# EAGLE design MF-DECODER (EAGLE 5.10)

## Sheet 1 of 4
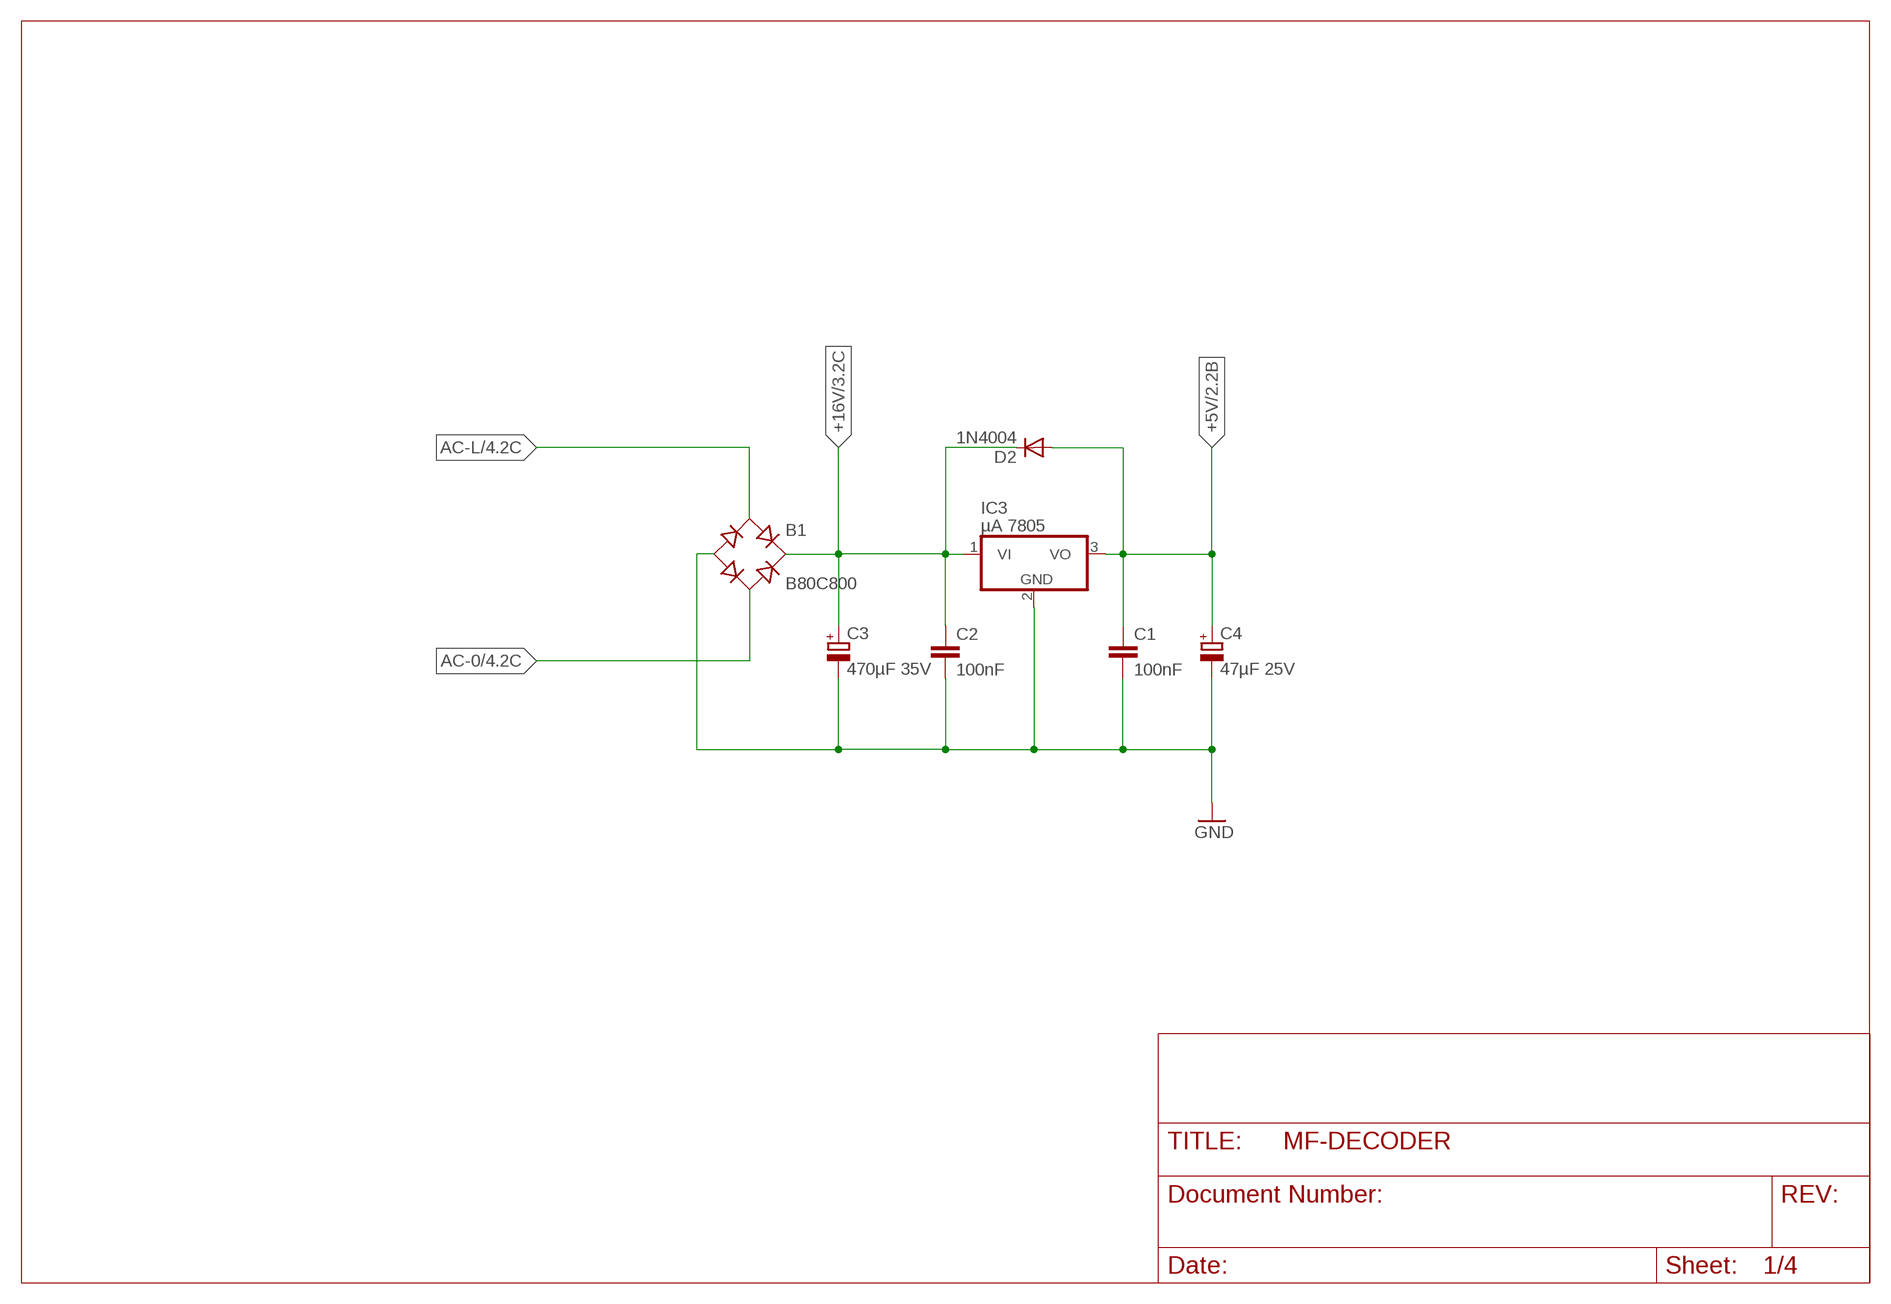
[diagram p0: schematic, sheet 1]

### Parts
B1  B80C800  RECTIFIER-B40S  [B40S]
C1  100nF  C2.5/2  [C2.5-2]
C2  100nF  C2.5/2  [C2.5-2]
C3  470µF 35V  CPOL-EUE5-10.5  [E5-10,5]
C4  47µF 25V  CPOL-EUE2.5-5  [E2,5-5]
D2  1N4004  [DO41-10]
IC3  µA 7805  7805TV  [TO220V]

### Nets
+5V: C1.1 C4.+ D2.A IC3.3(VO) ; also sheet 2,3,4
+16V: B1.+ C2.1 C3.+ D2.C IC3.1(VI) ; also sheet 3,4
AC-0: B1.AC2 ; also sheet 4
AC-L: B1.AC1 ; also sheet 4
GND: B1.- C1.2 C2.2 C3.- C4.- IC3.2(GND) ; also sheet 2,3,4

## Sheet 2 of 4
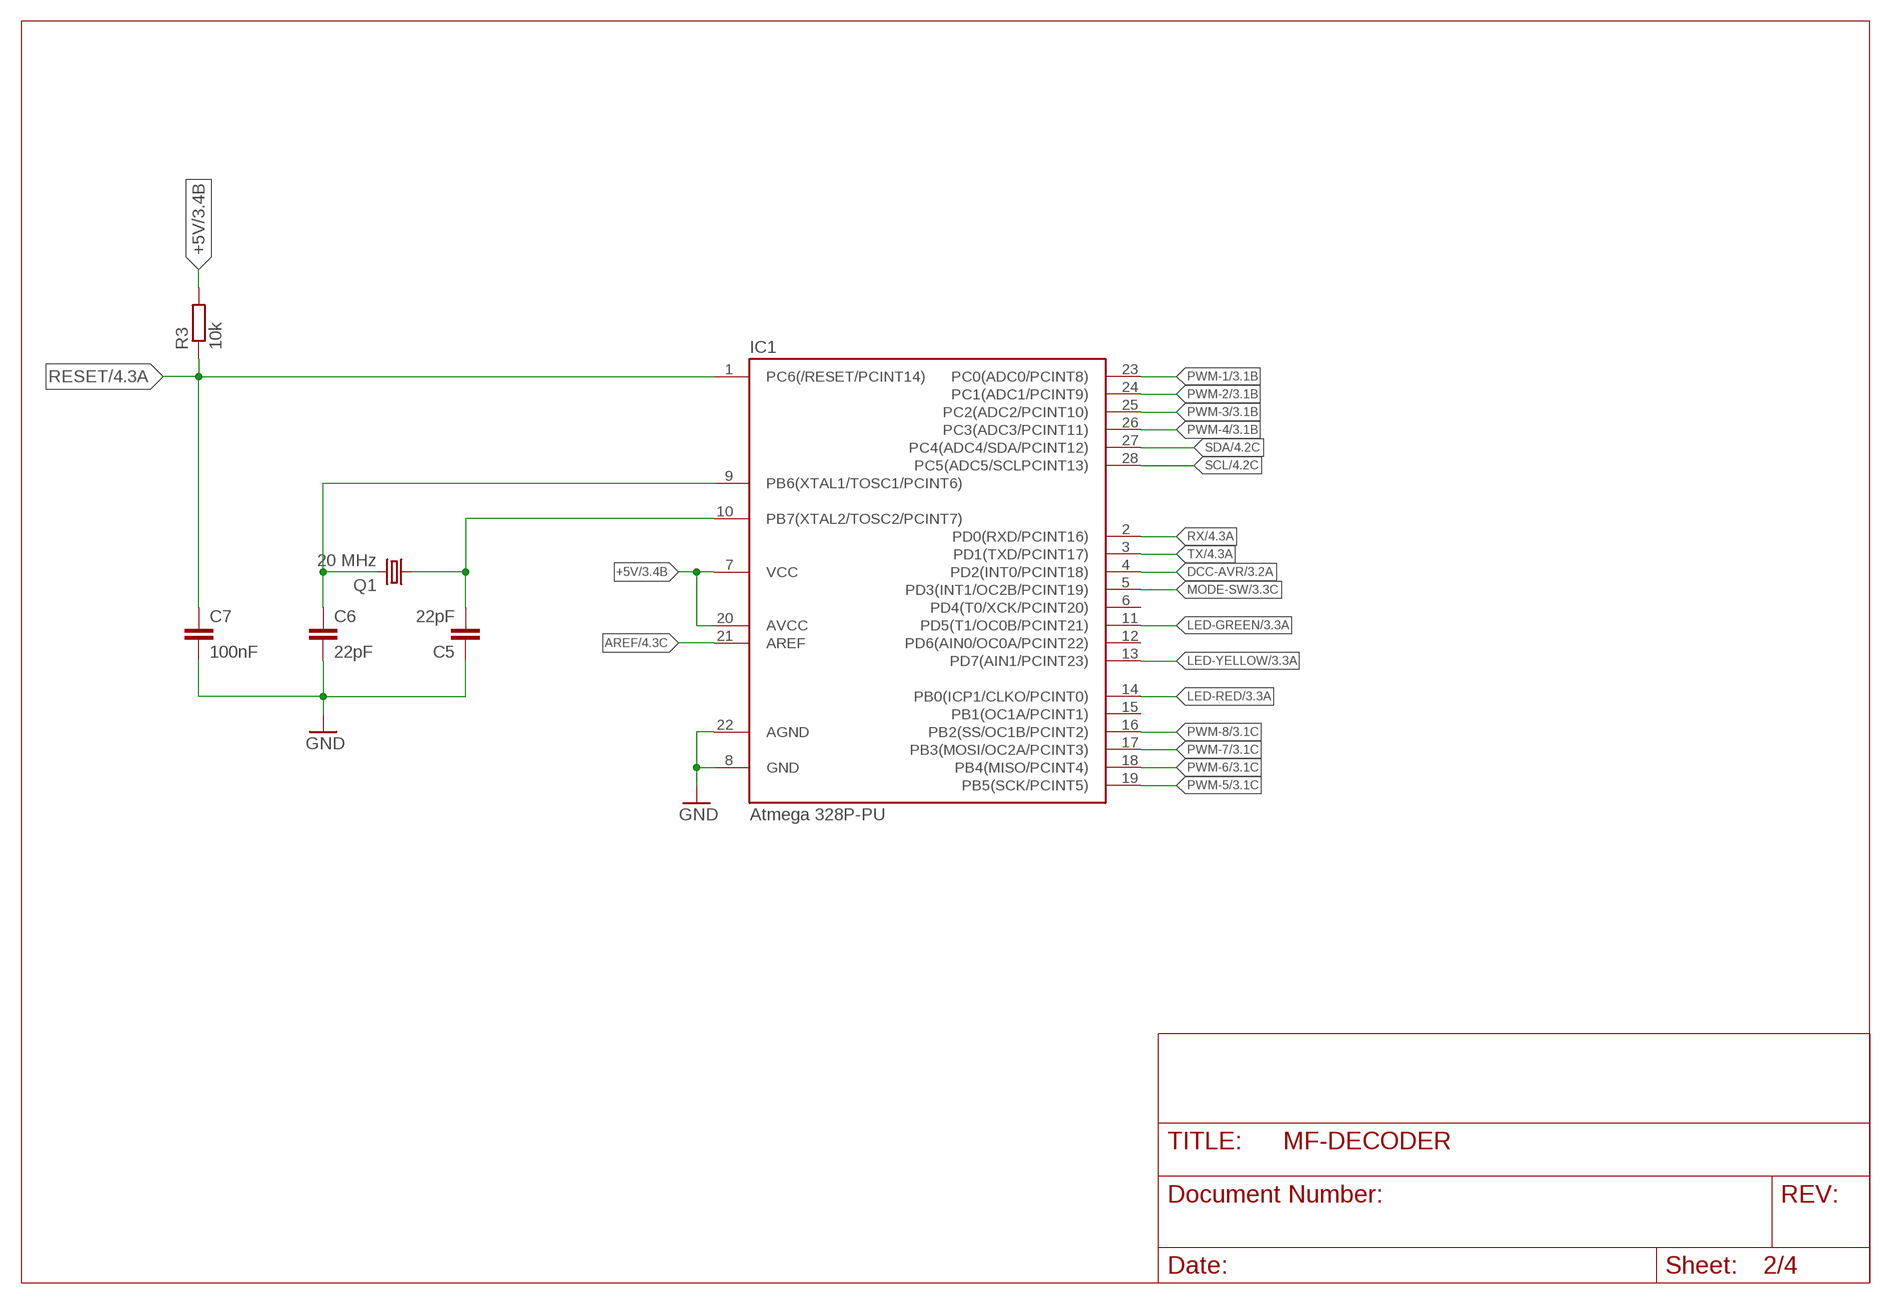
[diagram p1: schematic, sheet 2]

### Parts
C5  22pF  C2.5/2  [C2.5-2]
C6  22pF  C2.5/2  [C2.5-2]
C7  100nF  C2.5/2  [C2.5-2]
IC1  Atmega 328P-PU  MEGA48/88/168-PU  [DIL28-3]
Q1  20 MHz  CRYSTALHC49S  [HC49/S]
R3  10k  R-EU_R1206  [R1206]

### Nets
+5V: IC1.7(VCC) IC1.20(AVCC) R3.2 ; also sheet 1,3,4
AREF: IC1.21(AREF) ; also sheet 4
DCC-AVR: IC1.4(PD2(INT0/PCINT18)) ; also sheet 3
GND: C5.1 C6.2 C7.2 IC1.8(GND) IC1.22(AGND) ; also sheet 1,3,4
LED-GREEN: IC1.11(PD5(T1/OC0B/PCINT21)) ; also sheet 3
LED-RED: IC1.14(PB0(ICP1/CLKO/PCINT0)) ; also sheet 3
LED-YELLOW: IC1.13(PD7(AIN1/PCINT23)) ; also sheet 3
MODE-SW: IC1.5(PD3(INT1/OC2B/PCINT19)) ; also sheet 3
PWM-1: IC1.23(PC0(ADC0/PCINT8)) ; also sheet 3
PWM-2: IC1.24(PC1(ADC1/PCINT9)) ; also sheet 3
PWM-3: IC1.25(PC2(ADC2/PCINT10)) ; also sheet 3
PWM-4: IC1.26(PC3(ADC3/PCINT11)) ; also sheet 3
PWM-5: IC1.19(PB5(SCK/PCINT5)) ; also sheet 3,4
PWM-6: IC1.18(PB4(MISO/PCINT4)) ; also sheet 3,4
PWM-7: IC1.17(PB3(MOSI/OC2A/PCINT3)) ; also sheet 3,4
PWM-8: IC1.16(PB2(SS/OC1B/PCINT2)) ; also sheet 3
RESET: C7.1 IC1.1(PC6(/RESET/PCINT14)) R3.1 ; also sheet 4
RX: IC1.2(PD0(RXD/PCINT16)) ; also sheet 4
SCL: IC1.28(PC5(ADC5/SCLPCINT13)) ; also sheet 4
SDA: IC1.27(PC4(ADC4/SDA/PCINT12)) ; also sheet 4
TX: IC1.3(PD1(TXD/PCINT17)) ; also sheet 4
XTAL1: C6.1 IC1.9(PB6(XTAL1/TOSC1/PCINT6)) Q1.2
XTAL2: C5.2 IC1.10(PB7(XTAL2/TOSC2/PCINT7)) Q1.1
Unconnected: IC1.6(PD4(T0/XCK/PCINT20)) IC1.12(PD6(AIN0/OC0A/PCINT22)) IC1.15(PB1(OC1A/PCINT1))

## Sheet 3 of 4
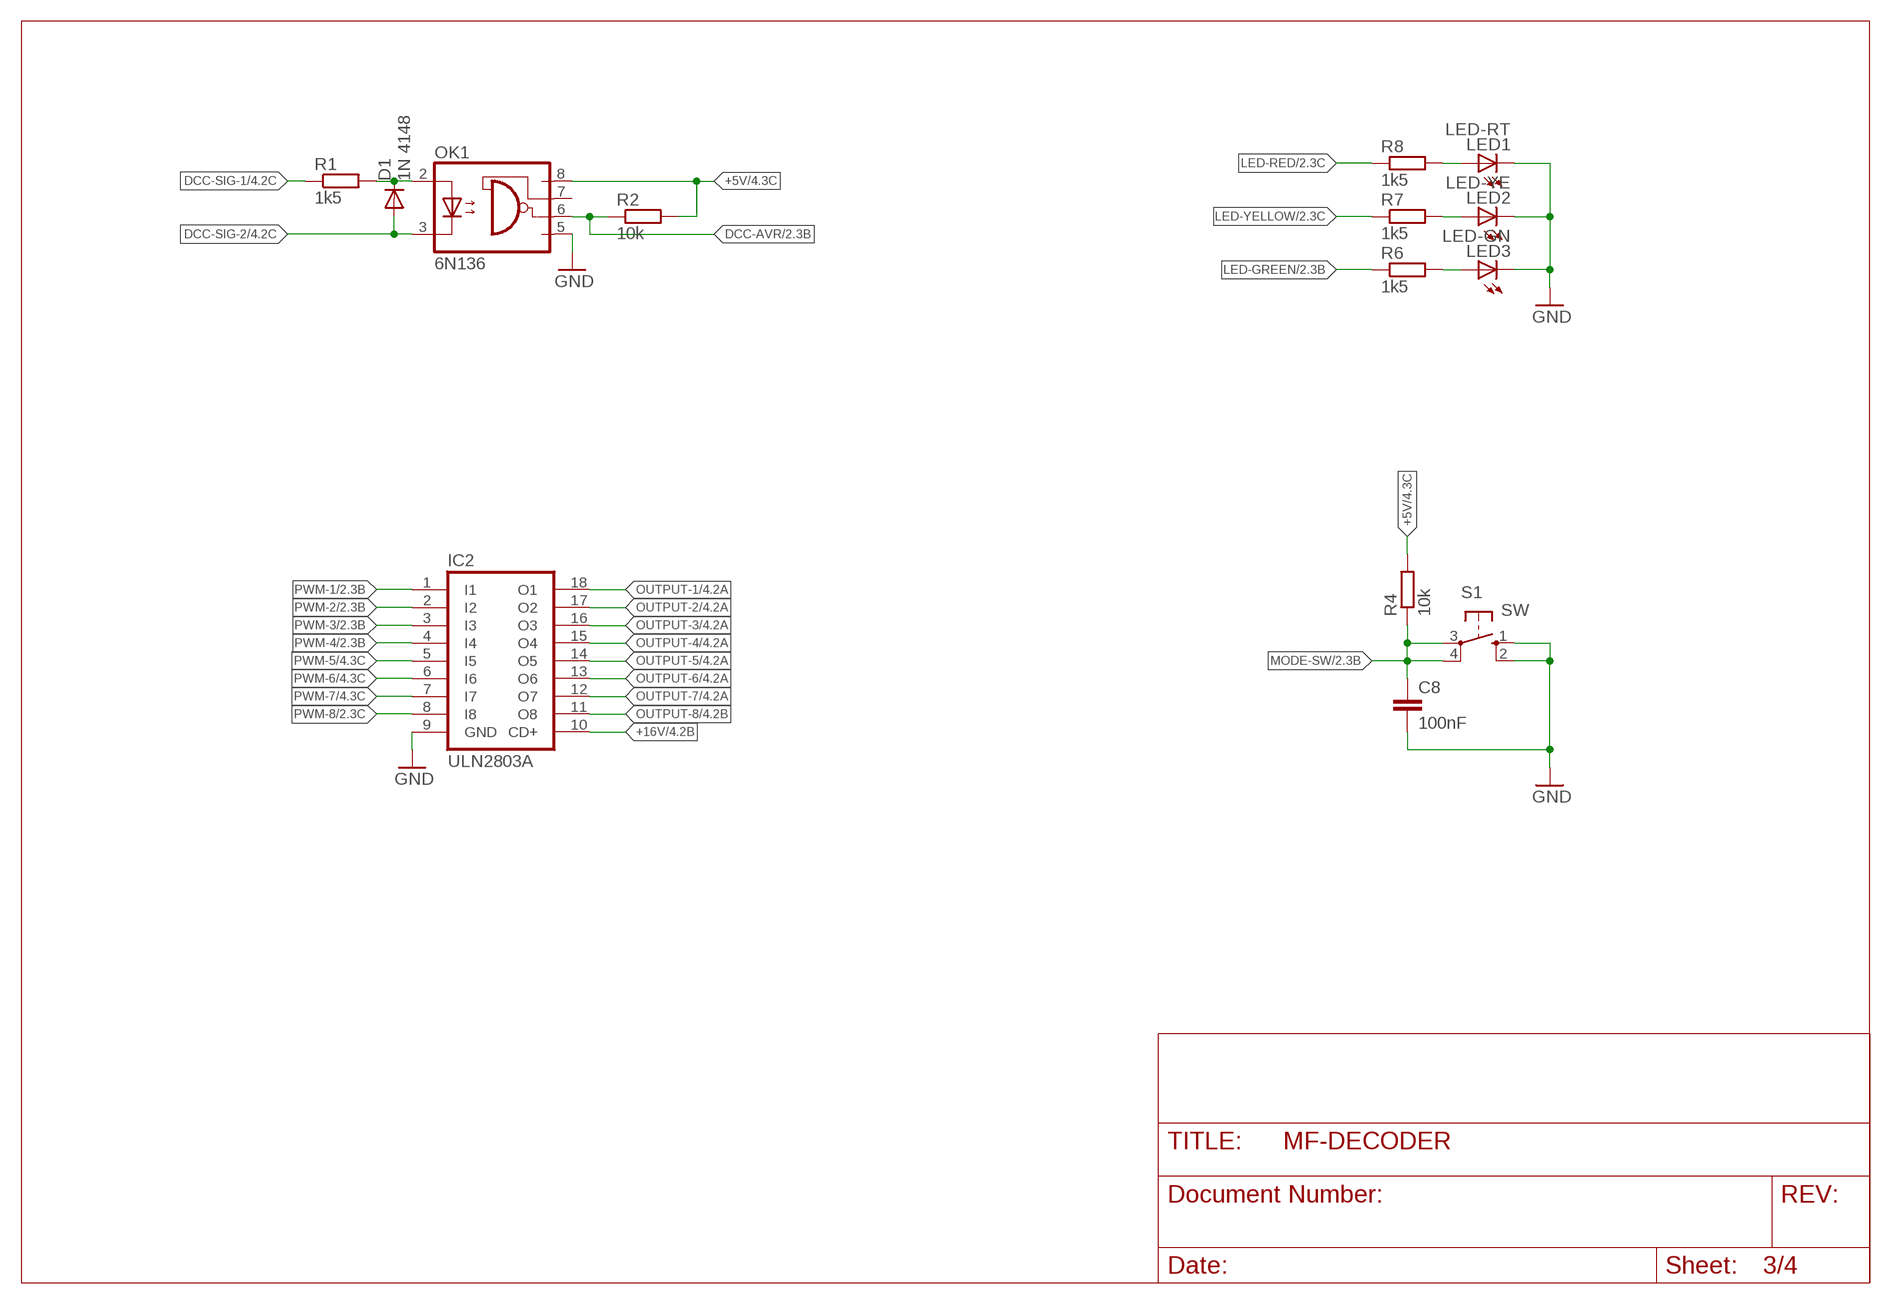
[diagram p2: schematic, sheet 3]

### Parts
C8  100nF  C2.5/2  [C2.5-2]
D1  1N 4148  DIODE-SOD80C  [SOD80C]
IC2  ULN2803A  [DIL18]
LED1  LED-RT  LED3MM  [LED3MM]
LED2  LED-YE  LED3MM  [LED3MM]
LED3  LED-GN  LED3MM  [LED3MM]
OK1  6N136  6N137  [DIL08]
R1  1k5  R-EU_R1206  [R1206]
R2  10k  R-EU_R1206  [R1206]
R4  10k  R-EU_R1206  [R1206]
R6  1k5  R-EU_R1206  [R1206]
R7  1k5  R-EU_R1206  [R1206]
R8  1k5  R-EU_R1206  [R1206]
S1  SW  10-XX  [B3F-10XX]

### Nets
+5V: OK1.8(VCC) R2.2 R4.2 ; also sheet 1,2,4
+16V: IC2.10(CD+) ; also sheet 1,4
DCC-AVR: OK1.6(VO) R2.1 ; also sheet 2
DCC-SIG-1: R1.1 ; also sheet 4
DCC-SIG-2: D1.A OK1.3(C) ; also sheet 4
GND: C8.2 IC2.9(GND) LED1.K(C) LED2.K(C) LED3.K(C) OK1.5(GND) S1.1(S) S1.2(S1) ; also sheet 1,2,4
LED-GREEN: R6.1 ; also sheet 2
LED-RED: R8.1 ; also sheet 2
LED-YELLOW: R7.1 ; also sheet 2
MODE-SW: C8.1 R4.1 S1.3(P) S1.4(P1) ; also sheet 2
N$1: LED1.A R8.2
N$3: LED2.A R7.2
N$4: LED3.A R6.2
N$7: D1.C OK1.2(A) R1.2
OUTPUT-1: IC2.18(O1) ; also sheet 4
OUTPUT-2: IC2.17(O2) ; also sheet 4
OUTPUT-3: IC2.16(O3) ; also sheet 4
OUTPUT-4: IC2.15(O4) ; also sheet 4
OUTPUT-5: IC2.14(O5) ; also sheet 4
OUTPUT-6: IC2.13(O6) ; also sheet 4
OUTPUT-7: IC2.12(O7) ; also sheet 4
OUTPUT-8: IC2.11(O8) ; also sheet 4
PWM-1: IC2.1(I1) ; also sheet 2
PWM-2: IC2.2(I2) ; also sheet 2
PWM-3: IC2.3(I3) ; also sheet 2
PWM-4: IC2.4(I4) ; also sheet 2
PWM-5: IC2.5(I5) ; also sheet 2,4
PWM-6: IC2.6(I6) ; also sheet 2,4
PWM-7: IC2.7(I7) ; also sheet 2,4
PWM-8: IC2.8(I8) ; also sheet 2
Unconnected: OK1.7(VE)

## Sheet 4 of 4
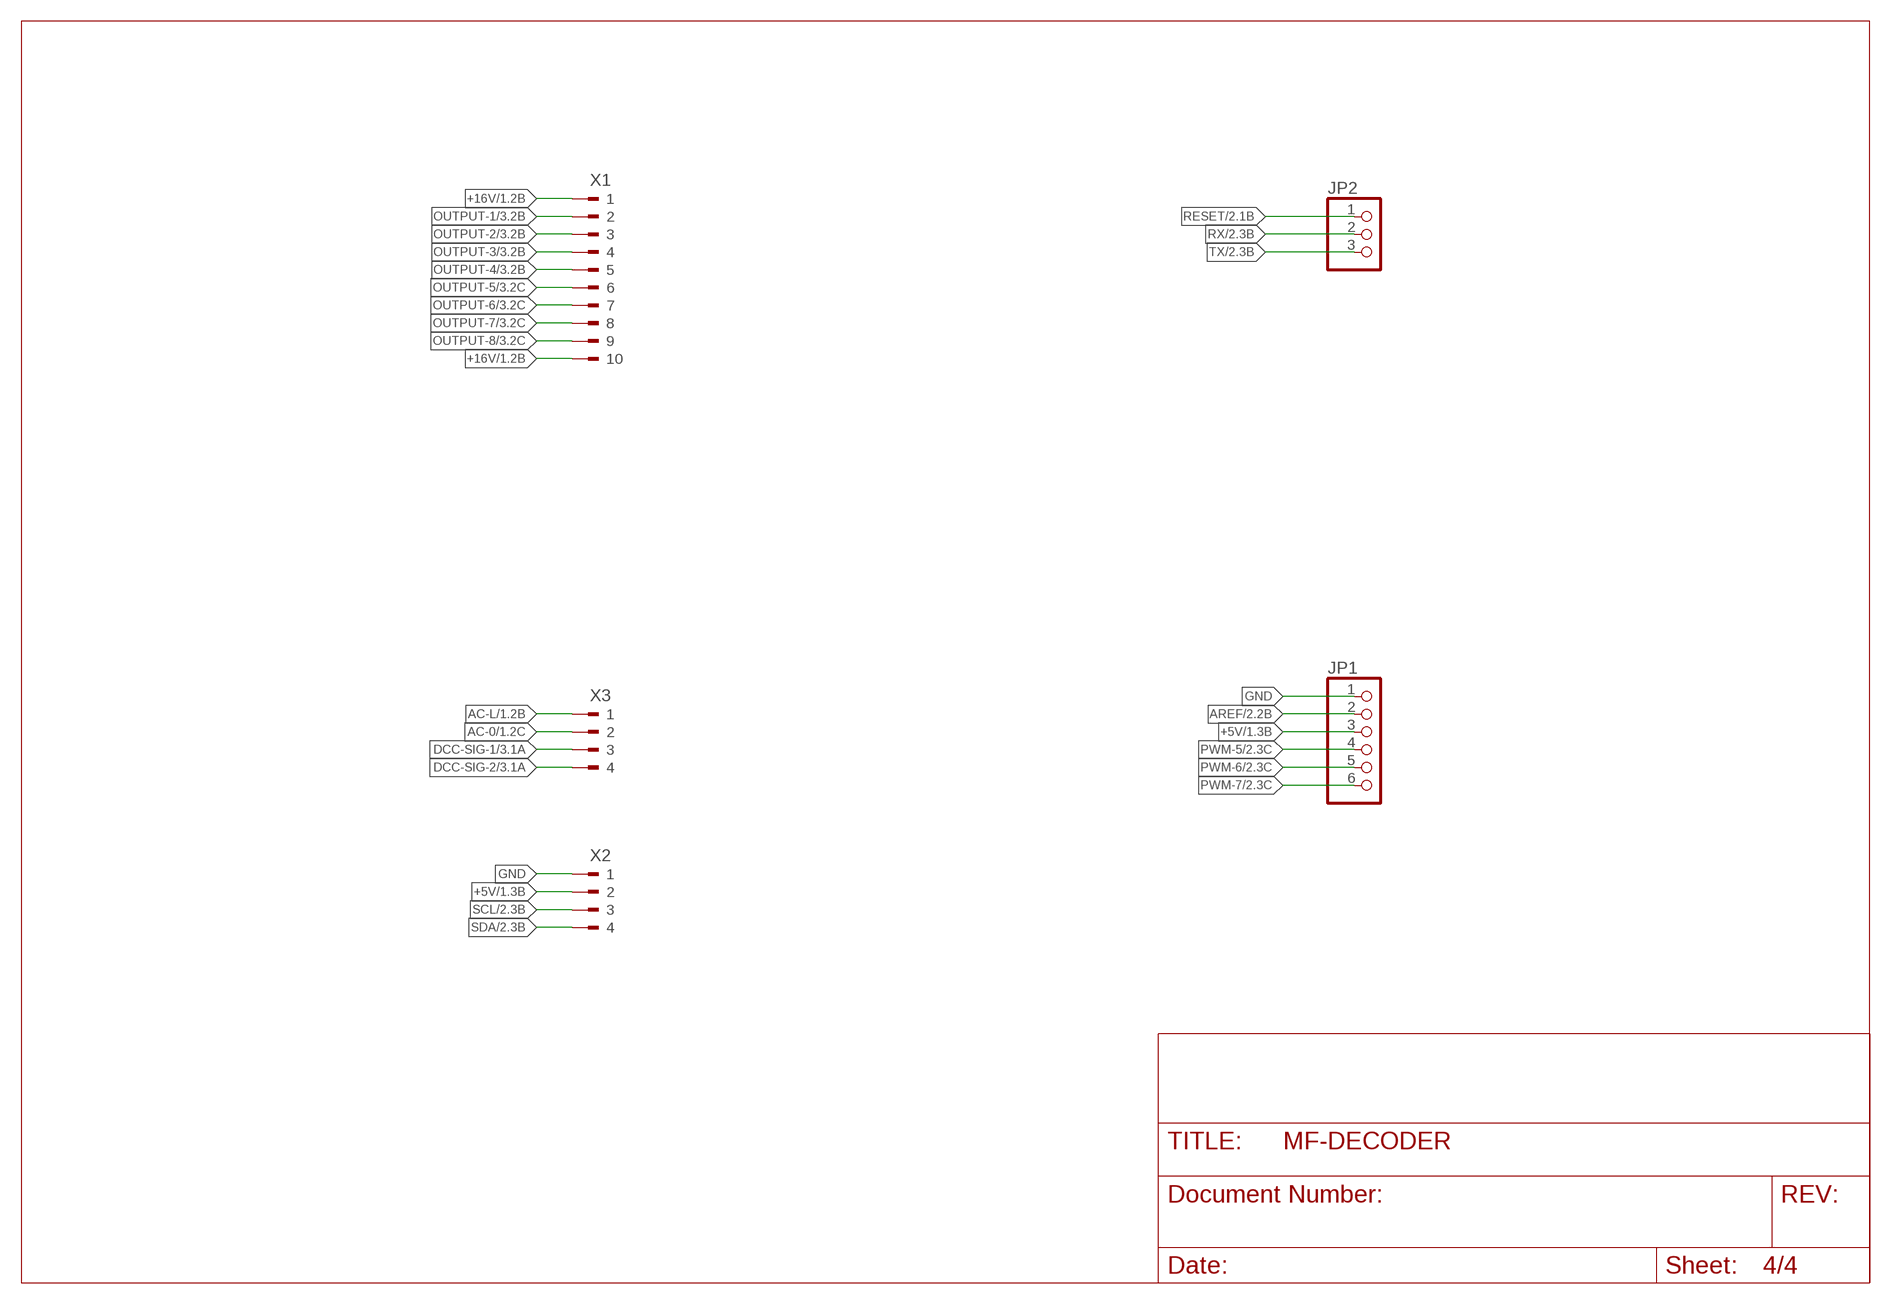
[diagram p3: schematic, sheet 4]

### Parts
JP1  PINHD-1X6  [1X06]
JP2  PINHD-1X3  [1X03]
X1  180G-10  [180G-10]
X2  180G-4  [180G-4]
X3  180G-4  [180G-4]

### Nets
+5V: JP1.3 X2.2 ; also sheet 1,2,3
+16V: X1.1 X1.10 ; also sheet 1,3
AC-0: X3.2 ; also sheet 1
AC-L: X3.1 ; also sheet 1
AREF: JP1.2 ; also sheet 2
DCC-SIG-1: X3.3 ; also sheet 3
DCC-SIG-2: X3.4 ; also sheet 3
GND: JP1.1 X2.1 ; also sheet 1,2,3
OUTPUT-1: X1.2 ; also sheet 3
OUTPUT-2: X1.3 ; also sheet 3
OUTPUT-3: X1.4 ; also sheet 3
OUTPUT-4: X1.5 ; also sheet 3
OUTPUT-5: X1.6 ; also sheet 3
OUTPUT-6: X1.7 ; also sheet 3
OUTPUT-7: X1.8 ; also sheet 3
OUTPUT-8: X1.9 ; also sheet 3
PWM-5: JP1.4 ; also sheet 2,3
PWM-6: JP1.5 ; also sheet 2,3
PWM-7: JP1.6 ; also sheet 2,3
RESET: JP2.1 ; also sheet 2
RX: JP2.2 ; also sheet 2
SCL: X2.3 ; also sheet 2
SDA: X2.4 ; also sheet 2
TX: JP2.3 ; also sheet 2

## Library data of the parts
B1 = rectifier:RECTIFIER-: Rectifier
C1 C2 C5-C8 = capacitor-wima:C: CAPACITOR naming: grid - package width
C3 C4 = resistor:CPOL-EU: POLARIZED CAPACITOR, European symbol
D1 = diode:DIODE-: DIODE
D2 = diode:1N4004: DIODE general purpose rectifier, 1 A
IC1 = avr-6:MEGA48/88/168-PU
IC2 = uln-udn:ULN2803A: DRIVER ARRAY
IC3 = linear:78*: Positive VOLTAGE REGULATOR Source: http://cache.national.com/ds/LM/LM78L05.pdf http://www.fairchildsemi.com/ds/LM/LM7805.pdf
JP1 = pinhead:PINHD-1X6: PIN HEADER
JP2 = pinhead:PINHD-1X3: PIN HEADER
LED1-LED3 = led:LED: LED OSRAM: - CHIPLED LG R971, LG N971, LY N971, LG Q971, LY Q971, LO R971, LY R971 LH N974, LH R974 LS Q976, LO Q976, LY Q976 LO Q996 - Hyper CHIPLED LW Q18S LB Q993, LB Q99A, LB R99A - SideLED LS A670, LO A670, LY A670, LG A670, LP A670 LB A673, LV A673, LT A673, LW A673 LH A674 LY A675 LS A676, LA A676, LO A676, LY A676, LW A676 LS A679, LY A679, LG A679 - Hyper Micro SIDELED® LS Y876, LA Y876, LO Y876, LY Y876 LT Y87S - SmartLED LW L88C, LW L88S LB L89C, LB L89S, LG L890 LS L89K, LO L89K, LY L89K LS L896, LA L896, LO L896, LY L896 - TOPLED LS T670, LO T670, LY T670, LG T670, LP T670 LSG T670, LSP T670, LSY T670, LOP T670, LYG T670 LG T671, LOG T671, LSG T671 LB T673, LV T673, LT T673, LW T673 LH T674 LS T676, LA T676, LO T676, LY T676, LB T676, LH T676, LSB T676, LW T676 LB T67C, LV T67C, LT T67C, LS T67K, LO T67K, LY T67K, LW E67C LS E67B, LA E67B, LO E67B, LY E67B, LB E67C, LV E67C, LT E67C LW T67C LS T679, LY T679, LG T679 LS T770, LO T770, LY T770, LG T770, LP T770 LB T773, LV T773, LT T773, LW T773 LH T774 LS E675, LA E675, LY E675, LS T675 LS T776, LA T776, LO T776, LY T776, LB T776 LHGB T686 LT T68C, LB T68C - Hyper Mini TOPLED® LB M676 - Mini TOPLED Santana® LG M470 LS M47K, LO M47K, LY M47K Source: http://www.osram.convergy.de LUXEON: - LUMILED® LXK2-PW12-R00, LXK2-PW12-S00, LXK2-PW14-U00, LXK2-PW14-V00 LXK2-PM12-R00, LXK2-PM12-S00, LXK2-PM14-U00 LXK2-PE12-Q00, LXK2-PE12-R00, LXK2-PE12-S00, LXK2-PE14-T00, LXK2-PE14-U00 LXK2-PB12-K00, LXK2-PB12-L00, LXK2-PB12-M00, LXK2-PB14-N00, LXK2-PB14-P00, LXK2-PB14-Q00 LXK2-PR12-L00, LXK2-PR12-M00, LXK2-PR14-Q00, LXK2-PR14-R00 LXK2-PD12-Q00, LXK2-PD12-R00, LXK2-PD12-S00 LXK2-PH12-R00, LXK2-PH12-S00 LXK2-PL12-P00, LXK2-PL12-Q00, LXK2-PL12-R00 Source: www.luxeon.com KINGBRIGHT: KA-3528ASYC Source: www.kingbright.com
OK1 = optocoupler:6N137: MOTOROLA OPTO COUPLER
Q1 = crystal:CRYSTAL: CRYSTAL
R1-R4 R6-R8 = rcl:R-EU_: RESISTOR, European symbol
S1 = switch-omron:10-XX: OMRON SWITCH
X1 = con-weidmueller-sl35:180G-10: WEIDMUELLER CLAMP CONNECTOR
X2 X3 = con-weidmueller-sl35:180G-4: WEIDMUELLER CLAMP CONNECTOR

## Board
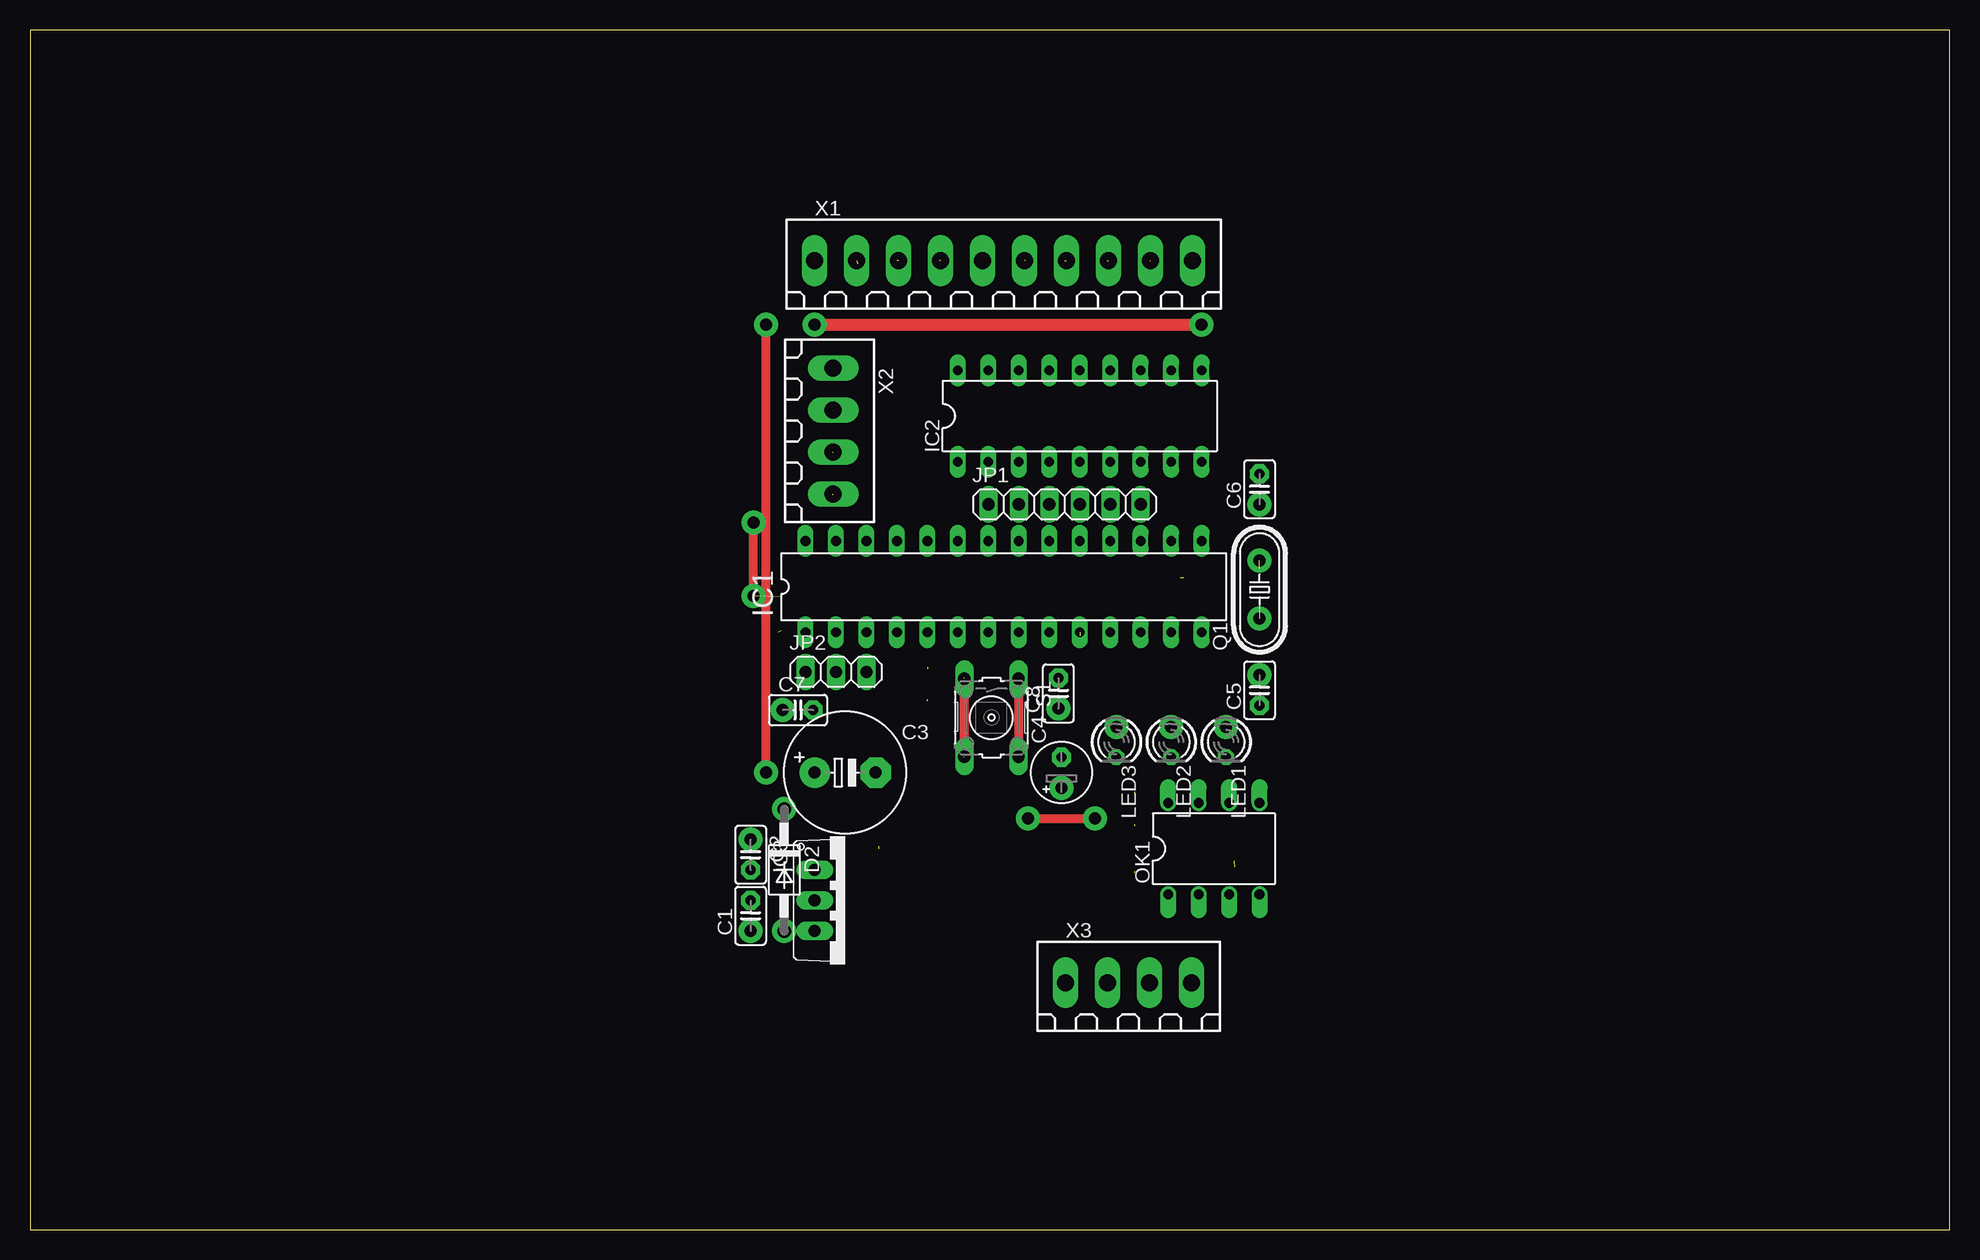
[diagram p4: board, top side]
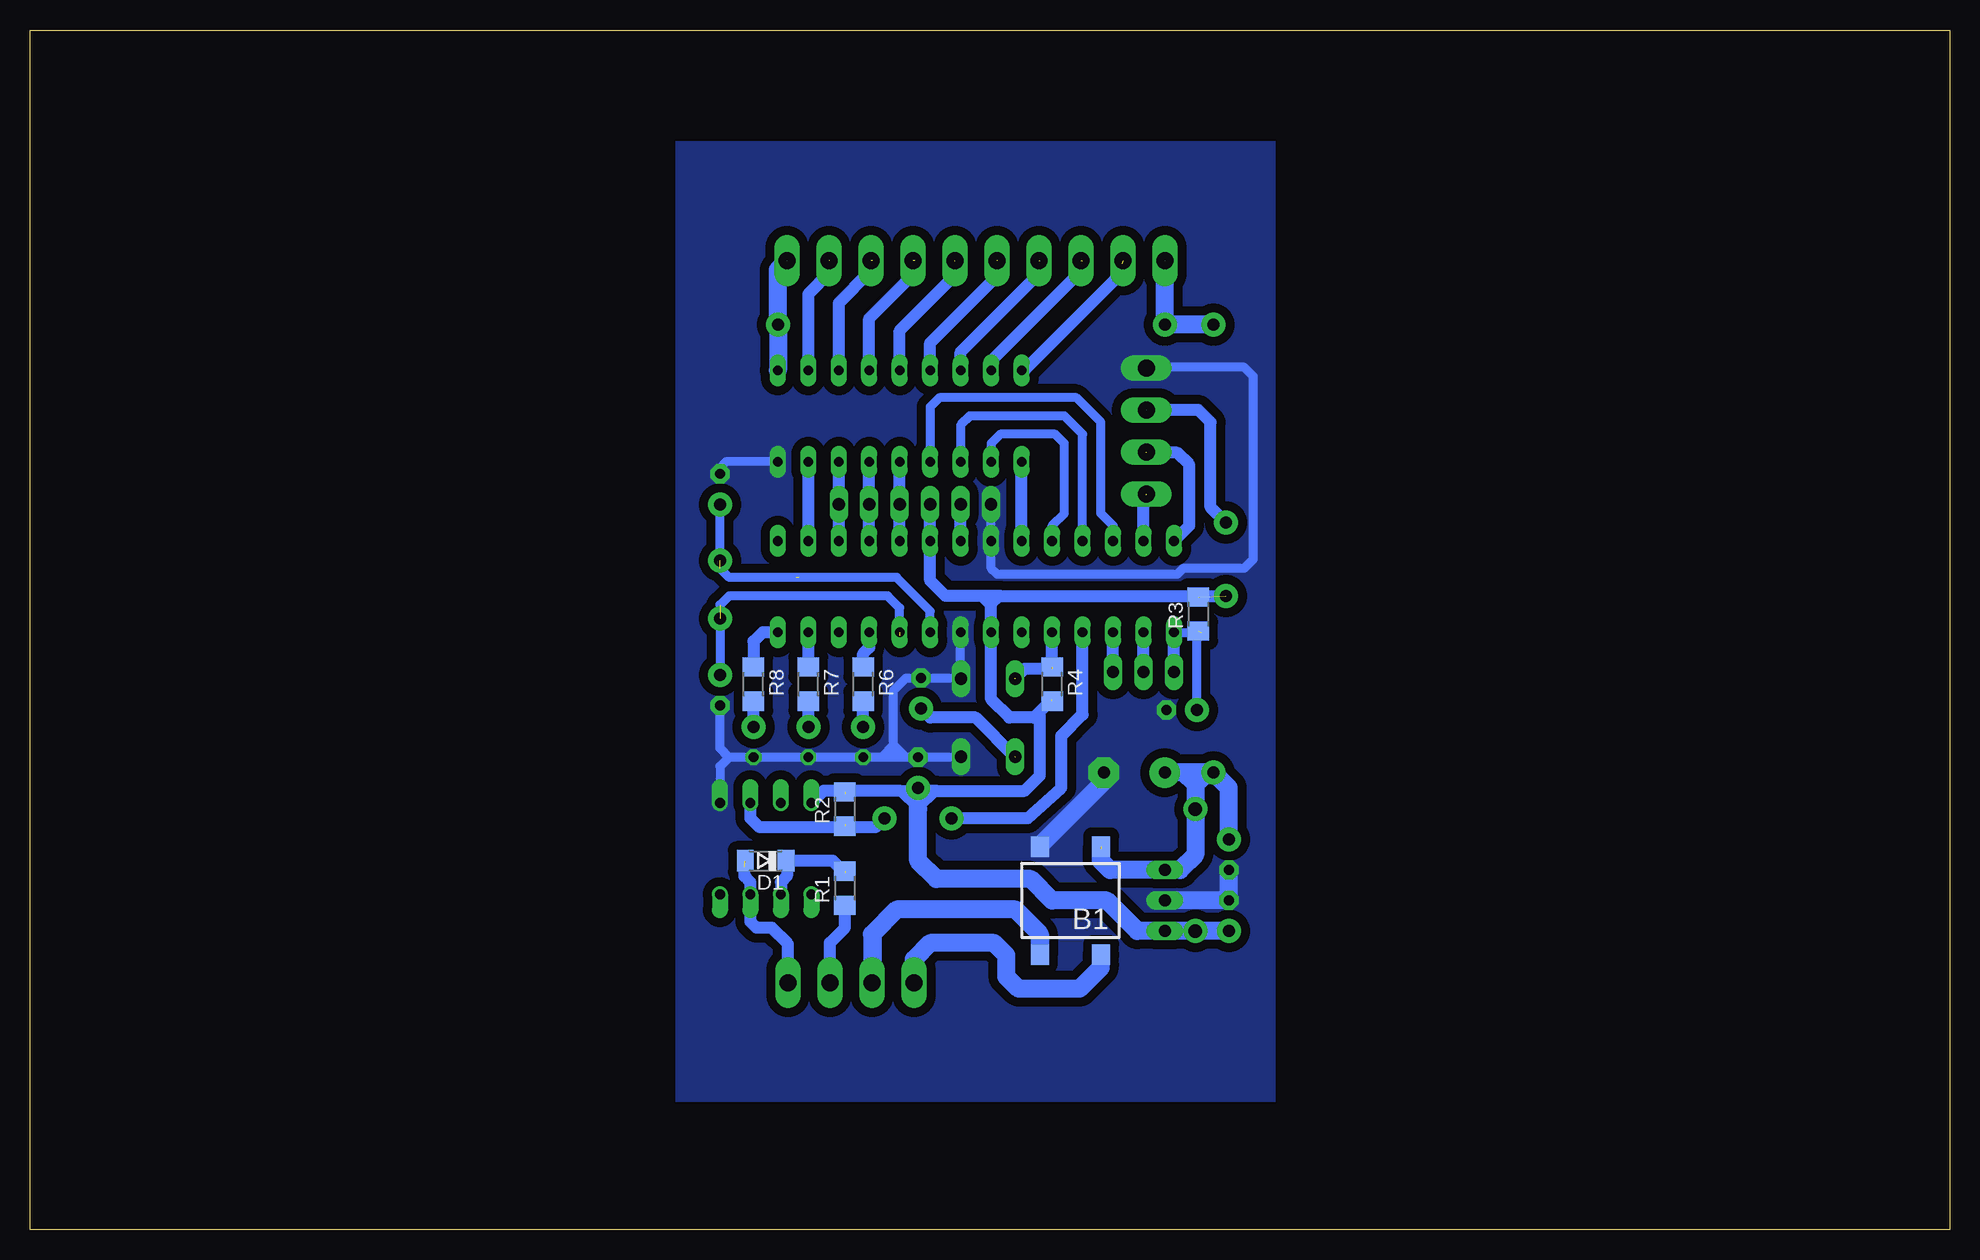
[diagram p5: board, bottom side, seen from below]

Size 160 x 100 mm. Coordinates in mm from the lower left corner, seen from the top.
Outline: 0,0 160,0 160,100 0,100 0,0
Copper layers (1*16): Top 0.035mm / dielectric 1.5mm / Bottom 0.035mm
Design rules "default": minimum track width 10mil, minimum drill 24mil, track to track 8mil, track to pad 8mil, pad to pad 8mil, via to via 8mil, smd to smd 8mil, copper to edge 40mil, drill to drill 8mil, minimum pad ring 10mil, minimum via ring 8mil, stop-mask expansion 4mil, vias tented up to drill 0mil, thermal gap 10mil

### Footprints (pad centres in the part's own frame; a part is rotated, then mirrored left to right if it is on the bottom)
B40S = smd 1.5 x 1.7: + -2.55,-4.5; - 2.55,-4.5; AC1 -2.55,4.5; AC2 2.55,4.5
C2.5-2 = drill 0.813 pad 1.6 octagon: 1 -1.27,0; 2 1.27,0
E5-10,5 = drill 1.016 pad 2.54 round: + -2.54,0 | drill 1.016 pad 2.54 octagon: - 2.54,0
E2,5-5 = drill 0.813 pad 1.6 round: + -1.27,0 | drill 0.813 pad 1.6 octagon: - 1.27,0
SOD80C = smd 1.4 x 1.8: A 1.7,0; C -1.7,0
DO41-10 = drill 1.118 round: A 5.08,0; C -5.08,0
DIL28-3 = drill 0.813 long: 1 -16.51,-3.81; 2 -13.97,-3.81; 3 -11.43,-3.81; 4 -8.89,-3.81; 5 -6.35,-3.81; 6 -3.81,-3.81; 7 -1.27,-3.81; 8 1.27,-3.81; 9 3.81,-3.81; 10 6.35,-3.81; 11 8.89,-3.81; 12 11.43,-3.81; 13 13.97,-3.81; 14 16.51,-3.81; 15 16.51,3.81; 16 13.97,3.81; 17 11.43,3.81; 18 8.89,3.81; 19 6.35,3.81; 20 3.81,3.81; 21 1.27,3.81; 22 -1.27,3.81; 23 -3.81,3.81; 24 -6.35,3.81; 25 -8.89,3.81; 26 -11.43,3.81; 27 -13.97,3.81; 28 -16.51,3.81
DIL18 = drill 0.813 long: 1 -10.16,-3.81; 2 -7.62,-3.81; 3 -5.08,-3.81; 4 -2.54,-3.81; 5 0,-3.81; 6 2.54,-3.81; 7 5.08,-3.81; 8 7.62,-3.81; 9 10.16,-3.81; 10 10.16,3.81; 11 7.62,3.81; 12 5.08,3.81; 13 2.54,3.81; 14 0,3.81; 15 -2.54,3.81; 16 -5.08,3.81; 17 -7.62,3.81; 18 -10.16,3.81
TO220V = drill 1.016 long: 1 -2.54,-2.54; 2 0,-2.54; 3 2.54,-2.54
1X06 = drill 1.016 long: 1 -6.35,0; 2 -3.81,0; 3 -1.27,0; 4 1.27,0; 5 3.81,0; 6 6.35,0
1X03 = drill 1.016 long: 1 -2.54,0; 2 0,0; 3 2.54,0
LED3MM = drill 0.813 octagon: A -1.27,0; K 1.27,0
DIL08 = drill 0.813 offset: 1 -3.81,-3.81; 2 -1.27,-3.81; 3 1.27,-3.81; 4 3.81,-3.81; 5 3.81,3.81; 6 1.27,3.81; 7 -1.27,3.81; 8 -3.81,3.81
HC49/S = drill 0.813 round: 1 -2.413,0; 2 2.413,0
R1206 = smd 1.6 x 1.803: 1 -1.422,0; 2 1.422,0
B3F-10XX = drill 1.016 long: 1 -3.251,2.261; 2 3.251,2.261; 3 -3.251,-2.261; 4 3.251,-2.261
180G-10 = drill 1.422 long: 1 -15.75,0; 2 -12.25,0; 3 -8.75,0; 4 -5.25,0; 5 -1.75,0; 6 1.75,0; 7 5.25,0; 8 8.75,0; 9 12.25,0; 10 15.75,0
180G-4 = drill 1.422 long: 1 -5.25,0; 2 -1.75,0; 3 1.75,0; 4 5.25,0

### Placement (x,y rotation side)
B1  73.28,27.43 180 bottom
C1  60.07,26.16 90 top
C2  60.07,31.24 270 top
C3  67.94,38.1 0 top
C4  85.98,38.1 90 top
C5  102.49,44.96 90 top
C6  102.49,61.72 90 top
C7  64.01,43.31 0 top
C8  85.72,44.7 90 top
D1  98.68,30.73 180 bottom
D2  62.87,29.97 270 top
IC1  81.15,53.59 0 top
IC2  87.5,67.82 0 top
IC3  67.94,27.43 270 top
JP1  86.23,60.45 0 top
JP2  67.18,46.48 0 top
LED1  99.69,40.64 270 top
LED2  95.12,40.64 270 top
LED3  90.55,40.64 270 top
OK1  98.68,31.75 0 top
Q1  102.49,53.34 90 top
R1  92.08,28.45 90 bottom
R2  92.08,35.05 90 bottom
R3  62.61,51.31 90 bottom
R4  74.8,45.47 270 bottom
R6  90.55,45.47 270 bottom
R7  95.12,45.47 270 bottom
R8  99.69,45.47 270 bottom
S1  80.14,42.67 270 top
X1  81.15,80.77 0 top
X2  66.94,66.58 270 top
X3  91.57,20.57 0 top

### Tracks (layer width: path | path; a pad name or v marks a point on that pad's centre or on a via)
+5V  (via drill 1 pad 2)  (4 unrouted)
  Top 0.75: v60.33,52.83 v60.33,58.93
  Bottom 0.75: 79.88,52.07 79.12,52.83 | IC1.20 85.22,57.4 | 85.72,36.58 C4.+ 86.23,36.58 | 75.82,42.67 76.33,42.67 75.82,42.16 | 91.82,36.58 92.84,36.58 92.58,36.32 | 91.82,36.58 91.57,36.58 92.08,36.07 | 91.82,36.58 92.08,36.32 | 84.45,36.58 85.98,35.05 87.5,36.58
  Bottom 1: JP1.3 IC1.20 84.96,54.1 83.69,52.83 80.64,52.83 | 80.64,52.83 79.88,52.07 IC1.7 79.88,44.2 78.36,42.67 76.33,42.67 75.82,43.18 | 80.64,52.83 79.12,52.83 v60.33,52.83 | X2.2 62.61,68.33 61.59,67.31 61.59,60.2 v60.33,58.93 | 75.82,43.18 75.82,42.67 75.82,42.16 75.82,37.85 77.09,36.58 84.45,36.58 85.72,36.58 | 75.82,43.18 74.8,44.2 | OK1.8 93.85,36.58 92.84,36.58 | 86.23,36.58 87.5,36.58 91.57,36.58
  Bottom 1.5: C1.1 D2.A IC3.3 67.69,24.89 70.23,27.43 74.8,27.43 76.58,29.21 84.45,29.21 85.98,30.73 85.98,35.05 C4.+
  other vias: 60.07,24.89 62.87,24.89 85.98,36.83
+16V  (via drill 1 pad 2)  (3 unrouted)
  Top 0.75: v61.34,38.1 v61.34,75.44
  Top 1: v65.41,75.44 v97.66,75.44
  Bottom 1.5: IC2.10 v97.66,75.44 97.66,80.01 X1.10 | X1.1 v65.41,75.44 v61.34,75.44 | 70.74,31.75 70.74,30.73 69.98,29.97 IC3.1 64.14,29.97 62.87,31.24 D2.C 62.87,37.08 | 61.85,38.1 v61.34,38.1 60.07,36.83 C2.1 | 61.85,38.1 62.87,38.1 | 62.87,38.1 63.88,38.1 | 63.88,38.1 C3.+ | 62.87,38.1 62.87,37.08 | 62.87,37.08 63.88,38.1 | 61.85,38.1 62.87,37.08
  other vias: 60.07,32.51 62.87,35.05
AC-0
  Bottom 1.5: X3.2 89.82,24.61 87.76,26.67 77.85,26.67 75.82,24.64 75.82,22.94 B1.AC2
AC-L
  Bottom 1.5: X3.1 86.32,22.52 84.96,23.88 79.63,23.88 78.61,22.86 78.61,21.08 77.6,20.07 72.52,20.07 70.74,21.84 B1.AC1
AREF
  Bottom 1: IC1.21 JP1.2
DCC-AVR  (via drill 1 pad 2)  (1 unrouted)
  Top 0.75: v83.19,34.29 v88.77,34.29
  Bottom 0.75: 92.58,33.78 92.33,33.53 91.82,33.53 92.08,33.78
  Bottom 1: IC1.4 72.26,42.93 74.04,41.15 74.04,36.83 76.83,34.29 v83.19,34.29 | 92.33,33.53 99.19,33.53 99.95,34.29 OK1.6 | 91.82,33.53 89.53,33.53 v88.77,34.29
DCC-SIG-1
  Bottom 1: X3.3 93.32,23.9 92.08,25.15 R1.1
DCC-SIG-2  (1 unrouted)
  Bottom 1: 100.46,30.23 100.46,29.46 99.95,28.96 OK1.3 99.95,25.65 99.44,25.15 98.17,25.15 96.82,23.79 X3.4
GND
  Bottom 0.75: JP1.1 IC1.22 79.88,55.12 79.38,54.61 64.39,54.61 63.88,55.12 58.8,55.12 58.04,55.88 58.04,71.12 58.8,71.88 66.93,71.88 | C5.1 102.49,40.13 101.73,39.37 | 101.73,39.37 LED1.K LED2.K LED3.K 89.03,39.37 | IC2.9 101.98,64.01 102.49,63.5 C6.2 | 82.42,39.37 87,39.37 | 87,39.37 88.01,39.37 | 88.01,39.37 89.03,39.37 | IC1.8 82.42,45.97 C8.2 87,45.97 88.01,44.96 88.01,40.39 | 88.01,39.37 88.01,40.39 | 87,39.37 88.01,40.39 | 88.01,40.39 89.03,39.37 | 101.73,39.37 102.49,38.61 OK1.5
  Bottom 1.5: 75.82,32 70.48,37.34 C3.- | C2.2 C1.2 IC3.2
  pour Bottom (isolate 0.75, no thermals): 56.17,90.68 106.17,90.68 106.17,10.68 56.17,10.68
LED-GREEN
  Bottom 1: R6.1 90.55,48.01 90.04,48.51 IC1.11
LED-RED
  Bottom 1: R8.1 99.69,49.02 98.93,49.78 IC1.14
LED-YELLOW
  Bottom 1: R7.1 IC1.13
MODE-SW  (via drill 1 pad 2)  (3 unrouted)
  Top 0.75: S1.4 S1.3
  Bottom 1: IC1.5 74.8,46.74 77.09,46.74 77.85,45.97 | 77.85,39.37 81.15,42.67 84.96,42.67 C8.1
  other vias: 85.72,43.43
N$1  (via drill 1 pad 2)
  Bottom 1: LED1.A R8.2
  other vias: 99.69,41.91
N$3  (via drill 1 pad 2)
  Bottom 1: LED2.A R7.2
  other vias: 95.12,41.91
N$4  (via drill 1 pad 2)
  Bottom 1: LED3.A R6.2
  other vias: 90.55,41.91
N$6
  Bottom 0.75: 99.95,26.67 99.95,27.69
N$7  (1 unrouted)
  Bottom 0.75: 96.9,30.15 D1.C 96.9,30.23 | 96.9,30.73 97.16,30.73
  Bottom 1: OK1.2 97.41,28.96 96.9,29.46 96.9,30.15 96.9,30.73 93.09,30.73 92.08,29.72
N$9
  Top 0.75: 82.42,39.37 82.42,45.97
N$13
  Bottom 1.5: 75.82,22.86 75.82,24.64 77.85,26.67 87.76,26.67 89.79,24.64 89.79,22.1
OUTPUT-1  (1 unrouted)
  Bottom 1: 68.96,80.52 68.96,79.76 77.09,71.63 IC2.18
OUTPUT-2  (1 unrouted)
  Bottom 1: IC2.17 79.88,72.39 72.52,79.76 72.52,80.52 72.26,80.77
OUTPUT-3  (1 unrouted)
  Bottom 1: IC2.16 82.42,73.15 76.07,79.5 76.07,80.52 75.82,80.77
OUTPUT-4  (1 unrouted)
  Bottom 1: IC2.15 84.96,73.91 79.38,79.5 79.38,80.77
OUTPUT-5  (1 unrouted)
  Bottom 1: IC2.14 87.5,74.93 82.93,79.5 82.93,80.77
OUTPUT-6  (1 unrouted)
  Bottom 1: IC2.13 90.04,75.95 86.49,79.5 86.49,80.52 86.23,80.77
OUTPUT-7  (1 unrouted)
  Bottom 1: IC2.12 92.58,77.22 90.04,79.76 90.04,80.52 89.79,80.77
OUTPUT-8  (1 unrouted)
  Bottom 1: IC2.11 95.12,77.98 93.34,79.76 93.34,80.77
PWM-1
  Bottom 1: IC1.23 IC2.1
PWM-2
  Bottom 0.75: IC2.2 79.88,65.53 79.12,66.29 74.55,66.29 73.79,65.53 73.79,59.69 74.8,58.67 IC1.24
PWM-3
  Bottom 0.75: IC1.25 72.26,66.29 73.79,67.82 81.66,67.82 82.42,67.06 IC2.3
PWM-4
  Bottom 0.75: IC2.4 84.96,68.58 84.2,69.34 72.77,69.34 70.74,67.31 70.74,59.69 69.72,58.67 IC1.26
PWM-5
  Bottom 1: IC1.19 JP1.4 IC2.5
PWM-6
  Bottom 1: IC1.18 JP1.5 IC2.6
PWM-7
  Bottom 1: IC1.17 JP1.6 IC2.7
PWM-8
  Bottom 1: IC1.16 IC2.8
RESET  (via drill 1 pad 2)  (1 unrouted)
  Bottom 0.75: IC1.1 62.36,49.78 | C7.1 62.74,49.28 62.61,49.28 R3.1
  Bottom 1: JP2.1 IC1.1
  other vias: 62.74,43.31
RX
  Bottom 1: JP2.2 IC1.2
SCL  (1 unrouted)
  Bottom 1: 66.93,64.77 64.39,64.77 63.37,63.75 63.37,58.67 IC1.28
SDA  (1 unrouted)
  Bottom 1: IC1.27 67.18,60.96 66.93,61.21
TX
  Bottom 1: JP2.3 IC1.3
XTAL1  (via drill 1 pad 2)  (2 unrouted)
  Bottom 0.75: IC1.9 84.96,51.56 87.76,54.36 95.89,54.36 | 96.14,54.36 101.73,54.36 102.49,55.12 C6.1
  other vias: 102.49,55.75 102.49,60.45
XTAL2  (via drill 1 pad 2)  (2 unrouted)
  Bottom 0.75: 87.5,49.53 87.5,51.82 88.52,52.83 101.73,52.83 102.49,52.07 C5.2
  other vias: 102.49,50.93 102.49,46.23